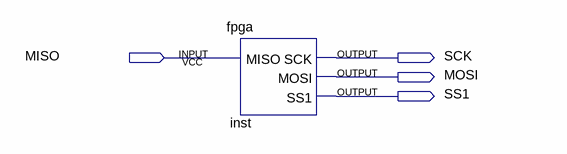
[diagram p0: schematic sheet]
// Quartus schematic fpga.bdf as structural Verilog: 1 symbols, 4 pins
module fpga (
  input  MISO,
  output SCK,
  output MOSI,
  output SS1
);

  fpga inst (.MISO(MISO), .SCK(SCK), .MOSI(MOSI), .SS1(SS1));
endmodule
